# EAGLE design LilyPad_Light_Sensor (EAGLE 7.2.0)
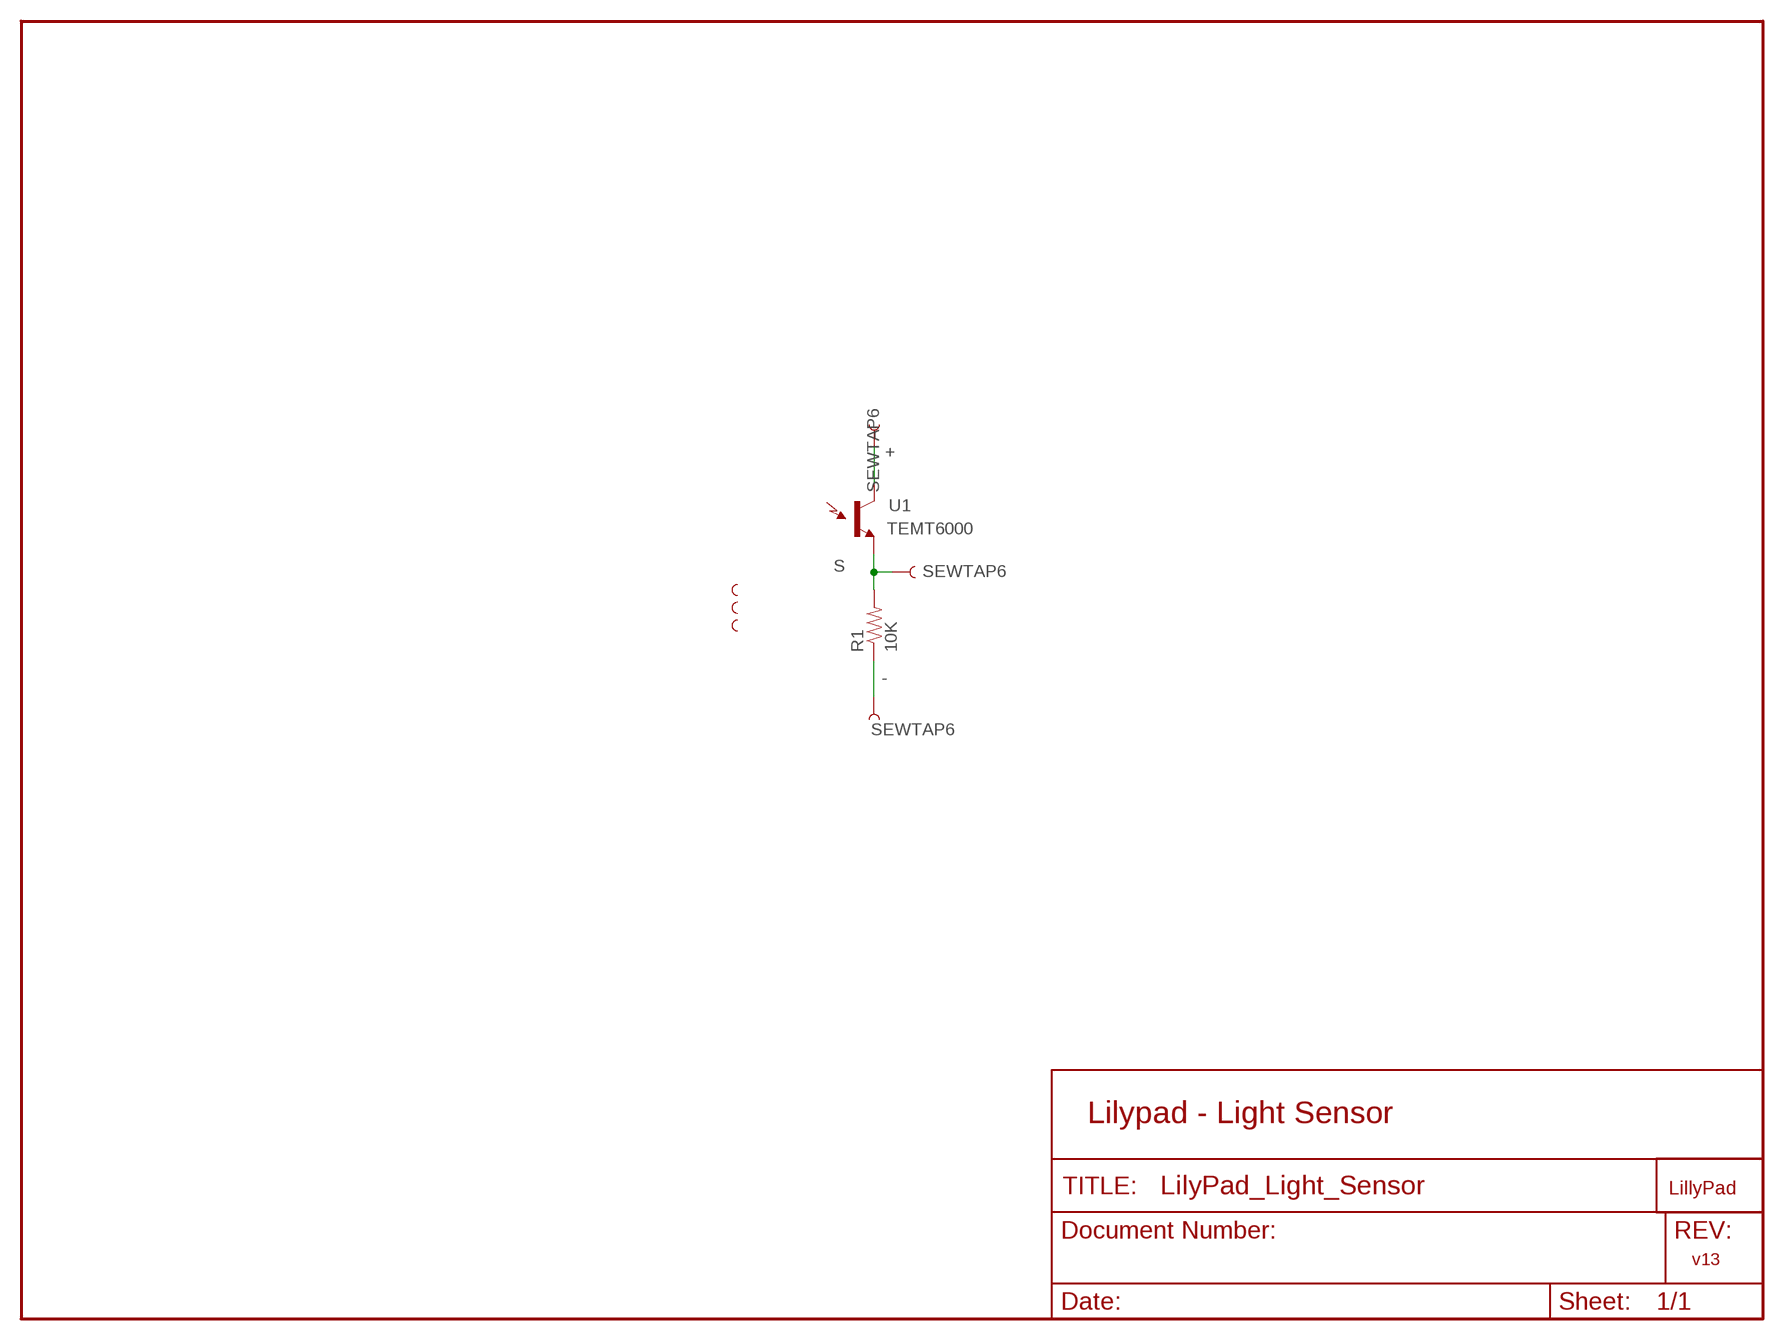
[diagram p0: schematic, sheet 1]

## Parts
LIGHT1  SEWTAP-NOHOLE2  [PETAL-NOHOLE-2SIDE]
LIGHT2  SEWTAP-NOHOLE2  [PETAL-NOHOLE-2SIDE]
LIGHT3  SEWTAP-NOHOLE2  [PETAL-NOHOLE-2SIDE]
LIGHT+  SEWTAP6  [PETAL-SMALL-2SIDE]
LIGHT-  SEWTAP6  [PETAL-SMALL-2SIDE]
LIGHTS  SEWTAP6  [PETAL-SMALL-2SIDE]
R1  10K  RESISTOR0402  [C0402]
U1  TEMT6000  [TEMT6000-SEN]
U$2  LOGO-LPLP  [LOGO-LILYPAD]

## Nets
+: LIGHT+.1 U1.COLLECTOR(C1)
-: LIGHT-.1 R1.1
S: LIGHTS.1 R1.2 U1.EMITTER(E1)

## Notes on the sheet
- Lilypad - Light Sensor
- v13

## Library data of the parts
LIGHT1-LIGHT3 = LilyPad-Wearables:SEWTAP-NOHOLE
LIGHT+ LIGHT- LIGHTS = LilyPad-Wearables:SEWTAP
R1 = SparkFun:RESISTOR: Resistor Basic schematic elements and footprints for 0603, 1206, and PTH 1/10th watt (small) resistors.
U1 = SparkFun:TEMT6000: Ambient Light Sensor Simple light detection sensor. Output varies with light intensity input. Spark Fun Electronics SKU : COM-08348
U$2 = LilyPad-Wearables:LOGO-LP

## Board
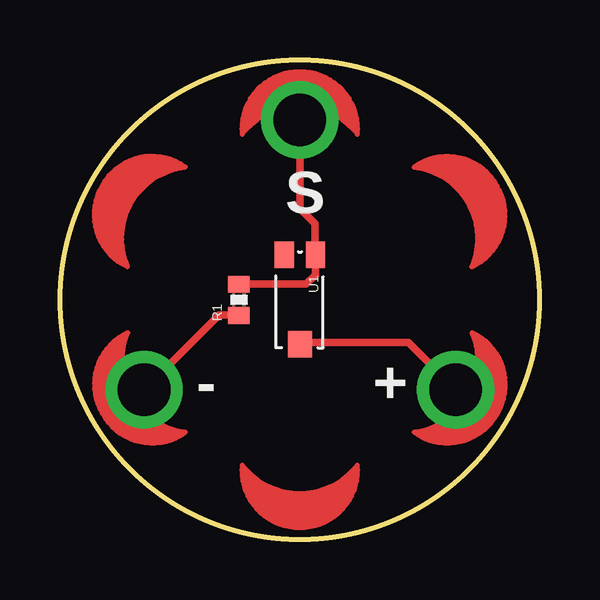
[diagram p1: board, top side]
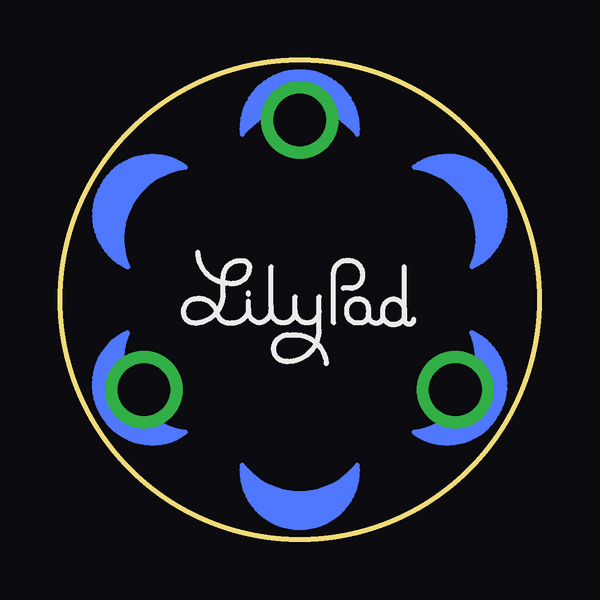
[diagram p2: board, bottom side, seen from below]

Size 20 x 20 mm. Coordinates in mm from the lower left corner, seen from the top.
Outline: circle at 10,10 radius 10
Copper layers (1*16): Top 0.035mm / dielectric 1.5mm / Bottom 0.035mm
Design rules "SparkFun": minimum track width 8mil, minimum drill 20mil, track to track 8mil, track to pad 8mil, pad to pad 8mil, via to via 8mil, smd to smd 8mil, copper to edge 8mil, drill to drill 8mil, minimum pad ring 12mil, minimum via ring 10mil, stop-mask expansion 4mil, vias tented up to drill 20mil, thermal gap 10mil

### Footprints (pad centres in the part's own frame; a part is rotated, then mirrored left to right if it is on the bottom)
PETAL-SMALL-2SIDE = drill 2.2: 1 0,0
0402-RES = smd 0.7 x 0.9: 1 -0.65,0; 2 0.65,0
TEMT6000-SEN = smd 1.1 x 0.8: BASE -1.87,-0.65; EMITTER -1.87,0.65 | smd 1.1 x 1: COLLECTOR 1.86,0.01

### Placement (x,y rotation side)
LIGHT1  3.5,13.76 240 top
LIGHT2  10,2.51 0 top
LIGHT3  16.49,13.75 120 top
LIGHT+  16.5,6.25 60 top
LIGHT-  3.51,6.25 300 top
LIGHTS  10,17.5 180 top
R1  10K  [0402-RES]  7.46,10 90 top
U1  10,10 270 top
U$2  10,10 0 bottom

### Tracks (layer width: path | path; a pad name or v marks a point on that pad's centre or on a via)
+
  Top 0.305: U1.COLLECTOR 10.09,8.22 14.53,8.22 LIGHT+.1
-
  Top 0.305: R1.1 7.46,9.37 6.62,9.37 LIGHT-.1
S
  Top 0.305: LIGHTS.1 10,13.81 10.63,13.18 10.63,11.86 | 10.63,11.86 10.63,11.78 | 10.63,11.86 U1.EMITTER 10.65,11.03 10.27,10.65 R1.2

### Text on the board
tPlace: S | - | +